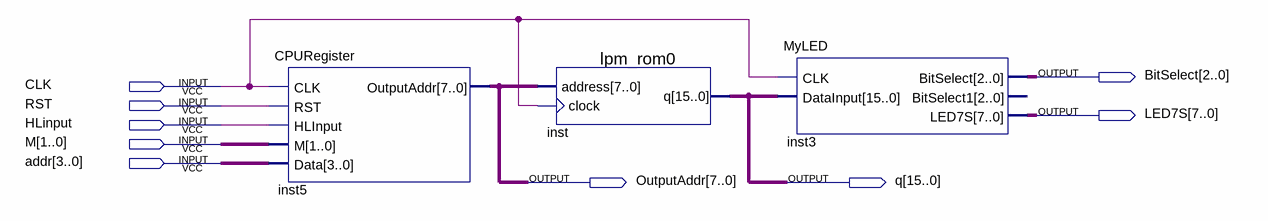
[diagram p0: schematic sheet]
// Quartus schematic CPUandROM.bdf as structural Verilog: 3 symbols, 9 pins
module CPUandROM (
  input  CLK,
  input  RST,
  input  HLinput,
  input  [1:0] M,
  input  [3:0] addr,
  output [2:0] BitSelect,
  output [7:0] LED7S,
  output [7:0] OutputAddr,
  output [15:0] q
);

  CPURegister inst5 (.CLK(CLK), .RST(RST), .HLInput(HLinput), .M(M), .Data(addr), .OutputAddr(OutputAddr));
  lpm_rom0 inst (.address(OutputAddr), .clock(CLK), .q(q));
  MyLED inst3 (.CLK(CLK), .DataInput(q), .BitSelect(BitSelect), .LED7S(LED7S));  // open: BitSelect1
endmodule
